# Altium schematic sheet Phase_Modulator_Transmitter.SchDoc
size A4
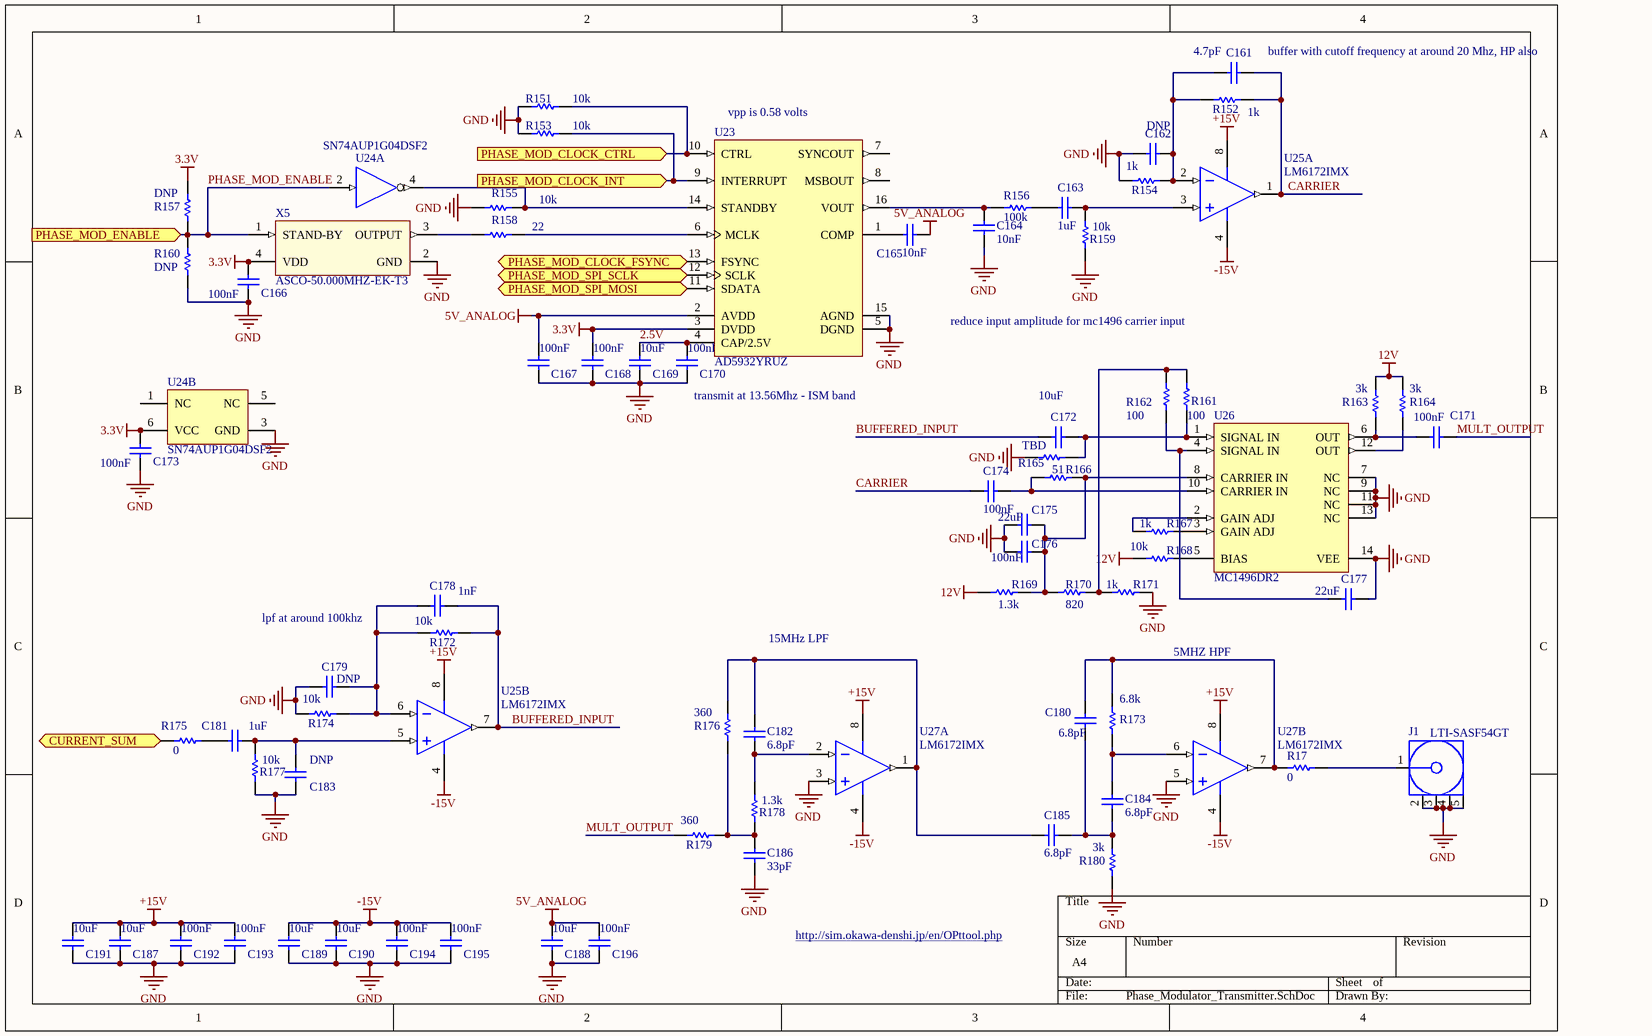
[diagram p0: Phase_Modulator_Transmitter.SchDoc]

## Parts
C161  value 4.7pF  [CAPC0402(1005)60_L]  (hidden comment: CAP0402)
C162  value DNP  [CAPC0402(1005)60_L]  (hidden comment: CAP0402)
C163  value 1uF  [CAPC0402(1005)60_L]  (hidden comment: CAP0402)
C164  value 10nF  [CAPC0402(1005)60_L]  (hidden comment: CAP0402)
C165  value 10nF  [CAPC0402(1005)60_L]  (hidden comment: CAP0402)
C166  value 100nF  [CAPC0402(1005)60_L]  (hidden comment: CAP0402)
C167  value 100nF  [CAPC0402(1005)60_L]  (hidden comment: CAP0402)
C168  value 100nF  [CAPC0402(1005)60_L]  (hidden comment: CAP0402)
C169  value 10uF  [CAPC0402(1005)60_L]  (hidden comment: CAP0402)
C170  value 100nF  [CAPC0402(1005)60_L]  (hidden comment: CAP0402)
C171  Tolerance: 100nF  [CAPC0402(1005)60_L]  (hidden comment: CAP0402)
C172  value 10uF  [CAPC0805(2012)145_L]  (hidden comment: CAP0805)
C173  value 100nF  [CAPC0402(1005)60_L]  (hidden comment: CAP0402)
C174  value 100nF  [CAPC0402(1005)60_L]  (hidden comment: CAP0402)
C175  value 22uF  [CAPC0805(2012)145_L]  (hidden comment: CAP0805)
C176  value 100nF  [CAPC0402(1005)60_L]  (hidden comment: CAP0402)
C177  value 22uF  [CAPC0805(2012)145_L]  (hidden comment: CAP0805)
C178  value 1nF  [CAPC0402(1005)60_L]  (hidden comment: CAP0402)
C179  value DNP  [CAPC0402(1005)60_L]  (hidden comment: CAP0402)
C180  value 6.8pF  [CAPC0402(1005)60_L]  (hidden comment: CAP0402)
C181  value 1uF  [CAPC0402(1005)60_L]  (hidden comment: CAP0402)
C182  value 6.8pF  [CAPC0402(1005)60_L]  (hidden comment: CAP0402)
C183  value DNP  [CAPC0402(1005)60_L]  (hidden comment: CAP0402)
C184  value 6.8pF  [CAPC0402(1005)60_L]  (hidden comment: CAP0402)
C185  value 6.8pF  [CAPC0402(1005)60_L]  (hidden comment: CAP0402)
C186  value 33pF  [CAPC0402(1005)60_L]  (hidden comment: CAP0402)
C187  value 10uF  [CAPC0805(2012)145_L]  (hidden comment: CAP0805)
C188  value 10uF  [CAPC0805(2012)145_L]  (hidden comment: CAP0805)
C189  value 10uF  [CAPC0805(2012)145_L]  (hidden comment: CAP0805)
C190  value 10uF  [CAPC0805(2012)145_L]  (hidden comment: CAP0805)
C191  value 10uF  [CAPC0805(2012)145_L]  (hidden comment: CAP0805)
C192  value 100nF  [CAPC0402(1005)60_L]  (hidden comment: CAP0402)
C193  value 100nF  [CAPC0402(1005)60_L]  (hidden comment: CAP0402)
C194  value 100nF  [CAPC0402(1005)60_L]  (hidden comment: CAP0402)
C195  value 100nF  [CAPC0402(1005)60_L]  (hidden comment: CAP0402)
C196  value 100nF  [CAPC0402(1005)60_L]  (hidden comment: CAP0402)
J1  LTI-SASF54GT  [LHT-LTI-SASF54GT_V]
R17  value 0  [RESC0402(1005)_L]  (hidden comment: RES0402)
R151  value 10k  [RESC0402(1005)_L]  (hidden comment: RES0402)
R152  value 1k  [RESC0402(1005)_L]  (hidden comment: RES0402)
R153  value 10k  [RESC0402(1005)_L]  (hidden comment: RES0402)
R154  value 1k  [RESC0402(1005)_L]  (hidden comment: RES0402)
R155  value 10k  [RESC0402(1005)_L]  (hidden comment: RES0402)
R156  value 100k  [RESC0402(1005)_L]  (hidden comment: RES0402)
R157  value DNP  [RESC0402(1005)_L]  (hidden comment: RES0402)
R158  value 22  [RESC0402(1005)_L]  (hidden comment: RES0402)
R159  value 10k  [RESC0402(1005)_L]  (hidden comment: RES0402)
R160  value DNP  [RESC0402(1005)_L]  (hidden comment: RES0402)
R161  value 100  [RESC0402(1005)_L]  (hidden comment: RES0402)
R162  value 100  [RESC0402(1005)_L]  (hidden comment: RES0402)
R163  value 3k  [RESC0402(1005)_L]  (hidden comment: RES0402)
R164  value 3k  [RESC0402(1005)_L]  (hidden comment: RES0402)
R165  value TBD  [RESC0402(1005)_L]  (hidden comment: RES0402)
R166  value 51  [RESC0402(1005)_L]  (hidden comment: RES0402)
R167  value 1k  [RESC0402(1005)_L]  (hidden comment: RES0402)
R168  value 10k  [RESC0402(1005)_L]  (hidden comment: RES0402)
R169  value 1.3k  [RESC0402(1005)_L]  (hidden comment: RES0402)
R170  value 820  [RESC0402(1005)_L]  (hidden comment: RES0402)
R171  value 1k  [RESC0402(1005)_L]  (hidden comment: RES0402)
R172  value 10k  [RESC0402(1005)_L]  (hidden comment: RES0402)
R173  value 6.8k  [RESC0402(1005)_L]  (hidden comment: RES0402)
R174  value 10k  [RESC0402(1005)_L]  (hidden comment: RES0402)
R175  value 0  [RESC0402(1005)_L]  (hidden comment: RES0402)
R176  value 360  [RESC0402(1005)_L]  (hidden comment: RES0402)
R177  value 10k  [RESC0402(1005)_L]  (hidden comment: RES0402)
R178  value 1.3k  [RESC0402(1005)_L]  (hidden comment: RES0402)
R179  value 360  [RESC0402(1005)_L]  (hidden comment: RES0402)
R180  value 3k  [RESC0402(1005)_L]  (hidden comment: RES0402)
U23  AD5932YRUZ  [ADI-RU-16_M]
U24  SN74AUP1G04DSF2  [DSF0006A_V]  (parts A,B of 2)
U25  LM6172IMX  [D0008A_L]  (parts A,B of 2)
U26  MC1496DR2  [ONSC-SOIC-14-751A-03_H_V]
U27  LM6172IMX  [D0008A_L]  (parts A,B of 2)
X5  ASCO-50.000MHZ-EK-T3  [ABRA-ASCO-50.000MHZ-EK-T3-4_V]

## Ports
CURRENT_SUM (in), PHASE_MOD_CLOCK_CTRL (in), PHASE_MOD_CLOCK_FSYNC (in), PHASE_MOD_CLOCK_INT (in), PHASE_MOD_ENABLE (in), PHASE_MOD_SPI_MOSI (in), PHASE_MOD_SPI_SCLK (in)

## Nets
3.3V: C166.1 C168.1 C173.1 R157.2 U23.3(DVDD) U24.6(VCC) X5.4(VDD)
5V_ANALOG: C165.2 C167.1 C188.2 C196.1 U23.2(AVDD)
12V: R163.1 R164.1 R168.2 R169.2
+15V: C187.2 C191.2 C192.1 C193.1 U25.8(V+) U27.8(V+)
-15V: C189.2 C190.2 C194.1 C195.1 U25.4(V-) U27.4(V-)
GND: C162.1 C164.1 C166.2 C167.2 C168.2 C169.2 C170.2 C173.2 C175.1 C176.1 C177.2 C179.1 C183.2 C186.2 C187.1 C188.1 C189.1 C190.1 C191.1 C192.2 C193.2 C194.2 C195.2 C196.2 J1.2 J1.3 J1.4 J1.5 R151.2 R153.2 R154.1 R155.2 R159.1 R160.1 R165.1 R171.1 R174.1 R177.2 R180.2 U23.5(DGND) U23.15(AGND) U24.3(GND) U26.7(NC) U26.9(NC) U26.11(NC) U26.13(NC) U26.14(VEE) U27.3(INA+) U27.5(INB+) X5.2(GND)
2.5V: C169.1 C170.1 U23.4(CAP/2.5V)
BUFFERED_INPUT: C172.1 C178.2 R172.2 U25.7(OUTB)
CARRIER: C161.2 C174.1 R152.2 U25.1(OUTA)
CURRENT_SUM: R175.1 ; port CURRENT_SUM
MULT_OUTPUT: C171.2 R179.1
PHASE_MOD_CLOCK_CTRL: R151.1 U23.10(CTRL) ; port PHASE_MOD_CLOCK_CTRL
PHASE_MOD_CLOCK_FSYNC: U23.13(FSYNC) ; port PHASE_MOD_CLOCK_FSYNC
PHASE_MOD_CLOCK_INT: R153.1 U23.9(INTERRUPT) ; port PHASE_MOD_CLOCK_INT
PHASE_MOD_ENABLE: R157.1 R160.2 U24.2(A) X5.1(STAND-BY) ; port PHASE_MOD_ENABLE
PHASE_MOD_SPI_MOSI: U23.11(SDATA) ; port PHASE_MOD_SPI_MOSI
PHASE_MOD_SPI_SCLK: U23.12(SCLK) ; port PHASE_MOD_SPI_SCLK
NetC161_1: C161.1 C162.2 R152.1 R154.2 U25.2(INA-)
NetC163_1: C163.1 R159.2 U25.3(INA+)
NetC163_2: C163.2 R156.1
NetC164_2: C164.2 R156.2 U23.16(VOUT)
NetC165_1: C165.1 U23.1(COMP)
NetC171_1: C171.1 R163.2 U26.6(OUT)
NetC172_2: C172.2 R161.2 R165.2 U26.1(SIGNAL_IN)
NetC174_2: C174.2 R166.2 U26.10(CARRIER_IN)
NetC175_2: C175.2 C176.2 R166.1 R169.1 R170.2 U26.8(CARRIER_IN)
NetC177_1: C177.1 R162.2 U26.4(SIGNAL_IN)
NetC178_1: C178.1 C179.2 R172.1 R174.2 U25.6(INB-)
NetC180_1: C180.1 C184.1 C185.1 R180.1
NetC180_2: C180.2 R17.1 R173.1 U27.7(OUTB)
NetC181_1: C181.1 R175.2
NetC181_2: C181.2 C183.1 R177.1 U25.5(INB+)
NetC182_1: C182.1 R178.2 U27.2(INA-)
NetC182_2: C182.2 C185.2 R176.2 U27.1(OUTA)
NetC184_2: C184.2 R173.2 U27.6(INB-)
NetC186_1: C186.1 R176.1 R178.1 R179.2
NetJ1_1: J1.1 R17.2
NetR155_1: R155.1 U23.14(STANDBY) U24.4(Y)
NetR158_1: R158.1 U23.6(MCLK)
NetR158_2: R158.2 X5.3(OUTPUT)
NetR161_1: R161.1 R162.1 R170.1 R171.2
NetR164_2: R164.2 U26.12(OUT)
NetR167_1: R167.1 U26.3(GAIN_ADJ)
NetR167_2: R167.2 U26.2(GAIN_ADJ)
NetR168_1: R168.1 U26.5(BIAS)

Not connected (* = marked no-connect by the designer): U23 7(SYNCOUT) 8(MSBOUT); U24 1(NC) 5(NC)

## Notes on the sheet
- (near U23) vpp is 0.58 volts
- buffer with cutoff frequency at around 20 Mhz, HP also
- reduce input amplitude for mc1496 carrier input
- (near C170) transmit at 13.56Mhz - ISM band
- lpf at around 100khz
- 15MHz LPF
- 5MHZ HPF
- http://sim.okawa-denshi.jp/en/OPttool.php

## Library data of the parts
C161-C171 C173 C174 C176 C178-C186 C192-C196 = CMP-1590-00004-1: 0402 (1005 Metric) Chip Capacitor; Case-EIA: 0402; Case-Metric: 1005; PackageReference: CAPC0402(1005)60
C172 C175 C177 C187-C191 = CMP-1590-00003-1: 0805 (2012 Metric) Chip Capacitor; Case-EIA: 0805; Case-Metric: 2012; PackageReference: CAPC0805(2012)145
J1 = CMP-1713-00001-1: SMA Connector, Pitch 2.54 mm, 1 Position, Height 9.5 mm, Tail Length 4 mm, RoHS; Manufacturer: Lighthorse Technologies Inc.; ComponentLink2Description: Datasheet; Mounting Technology: Through Hole; ComponentLink1Description: Manufacturer URL; PackageDescription: SMA Connector, Pitch 2.54 mm, 1 Position, Height 9.5 mm, Tail Length 4 mm; PartNumber: LTI-SASF54GT; PackageReference: LTI-SASF54GT; DatasheetVersion: Rev. May-99; ComponentLink2URL: http://rfconnector.com/sheets/SASF54GT.pdf; ComponentLink1URL: http://www.rfconnector.com
R17 R151-R180 = CMP-1591-00004-1: 0402 (1005 Metric) Chip Resistor; Case-EIA: 0402; Case-Metric: 1005; PackageReference: RESC0402(1005)
U23 = CMP-0293-00067-1: Programmable Frequency Scan Waveform Generator, 10-Bit, Serial, RU-16, 96 Tube, Pb-Free; I Supply total (max): 8mA; REFCLK Multiplier: Yes; Tuning Word Width (bits): 24bit; Resolution (Bits): 10bit; Master fclk: 50MHz; PackageVersion: Nov-2002; ComponentLink3Description: Package Specification; Code_JEDEC: MO-153AB; ComponentLink2Description: Datasheet; PackageDescription: 16-Lead Thin Shrink Small Outline Package [TSSOP]; DatasheetVersion: Rev. 0; I/O Interface: Serial; PackageReference: RU-16; ComponentLink1URL: www.analog.com; ComponentLink1Description: Manufacturer URL; ComponentLink2URL: http://www.analog.com/static/imported-files/data_sheets/AD5932.pdf; ComponentLink3URL: http://www.analog.com/static/imported-files/packages/36244347913743854010197452789RU16.pdf
U24 = CMP-0859-00902-3: Low-Power Single Inverter Gate, DSF0006A, LARGE T&R; Manufacturer: Texas Instruments; Output Drive (IOL/IOH)(Max)(mA): 20/-20; tpd @ Nom Voltage(Max)(ns): 25.4,16,10.8,9.2,6.5,5.4; VCC(Max)(V): 3.6; VCC(Min)(V): 0.8; Output Type: CMOS; Bits(#): 1; Sub-Family: Inverting Buffer/Driver; Voltage(Nom)(V): 0.8,1.2,1.5,1.8,2.5,3.3; Schmitt Trigger: No; F @ Nom Voltage(Max)(Mhz): 100; Rating: Catalog; ICC @ Nom Voltage(Max)(mA): 0.0009; Logic: Inverting; Technology Family: AUP; PackageReference: DSF0006A; Operating Temperature Range(C): -40 to 85; Generic Part Number: SN74AUP1G04; Input Type: CMOS; 3-State Output: No; DatasheetVersion: SCES571K
U25 U27 = CMP-0055-00808-3: Dual High Speed, Low Power, Low Distortion Voltage Feedback Amplifiers, 8-pin Narrow SOIC; Manufacturer: Texas Instruments; PackageTopMarking: NSZXTT*LM61*72IM; PowerWise: Y; ComponentLink1URL: http://www.ti.com/general/docs/lit/getliterature.tsp?genericPartNumber=LM6172&fileType=pdf; ComponentLink1Description: Datasheet URL; RoHS: N; Code_IPC: SOIC127P600-8; PackageDescription: SOIC Narrow, 4.9 x 3.9 x 1.45mm, 8 Lead, 1.27mm Pitch; PinCount: 8; CompType: Amplifiers; Code_JEDEC: MS-012-AA; Package Reference: D0008A
U26 = CMP-1320-00014-1: Balanced Modulator / Demodulator, 0 to 70 degC, 14-Pin SOIC, Tape and Reel; Manufacturer: On Semiconductor; ComponentLink2URL: http://www.onsemi.com/pub/Collateral/MC1496-D.PDF; ComponentLink1URL: http://www.onsemi.com/; Operating Temp Max: 70 degC; RoHS: FALSE; ComponentLink1Description: Manufacturer URL; PackageDescription: 14-Pin Small Outline Integrated Circuit, Body 8.65 x 3.9 mm, Pitch 1.27 mm; PackageVersion: Rev. H; ComponentLink3Description: Package Specification; ComponentLink2Description: Datasheet; Mounting Technology: Surface Mount; ComponentLink3URL: http://www.onsemi.com/pub_link/Collateral/MC74AC74-D.PDF; Operating Temp Min: 0 degC; Packing: Tape and Reel; PackageReference: SOIC-14-751A-03_H; DatasheetVersion: Rev. 10; PartNumber: MC1496DR2
X5 = CMP-0461-00001-3: Crystal Clock Oscillator, 50 MHz, -20 to 70 degC, 1.6 x 1.2 x 0.7 mm SMD; Manufacturer: Abracon; Frequency(MHz): 50; Aging: -3 to 3 3 ppm; Packing: Tape and Reel; Overall Frequency Stability: +/-30 ppm; Supply Current (Idd)
into 15pF Load: 6 mA; Supply Voltage (Vdd): 3.3 V; Output Load: 15 pF; ComponentLink2Description: Datasheet; ComponentLink3Description: Package Specification; ComponentLink3URL: http://www.abracon.com/Oscillators/ASCO.pdf; ComponentLink2URL: http://www.abracon.com/Oscillators/ASCO.pdf; Mounting Technology: Surface Mount; PackageDescription: 4-Pin Hand Drawn, Body 1.6 x 1.2 mm; DatasheetVersion: 01.25.13; ComponentLink1Description: Manufacturer URL; PartNumber: ASCO-50.000MHZ-EK-T3; Operating temperature: -20 to 70 degC; ComponentLink1URL: http://www.abracon.com; PackageReference: ASCO-50.000MHZ-EK-T3-4